# EasyEDA Pro project Camera.eprj

# Schematic Schematic1
Board Name: Board1; Create Date: 2025-09-21; Page Name: P1; Project Name: Camera; Schematic Name: Schematic1; Update Date: 2025-10-05; Company: 嘉立创EDA; Page Size: A4; Version: V1.0
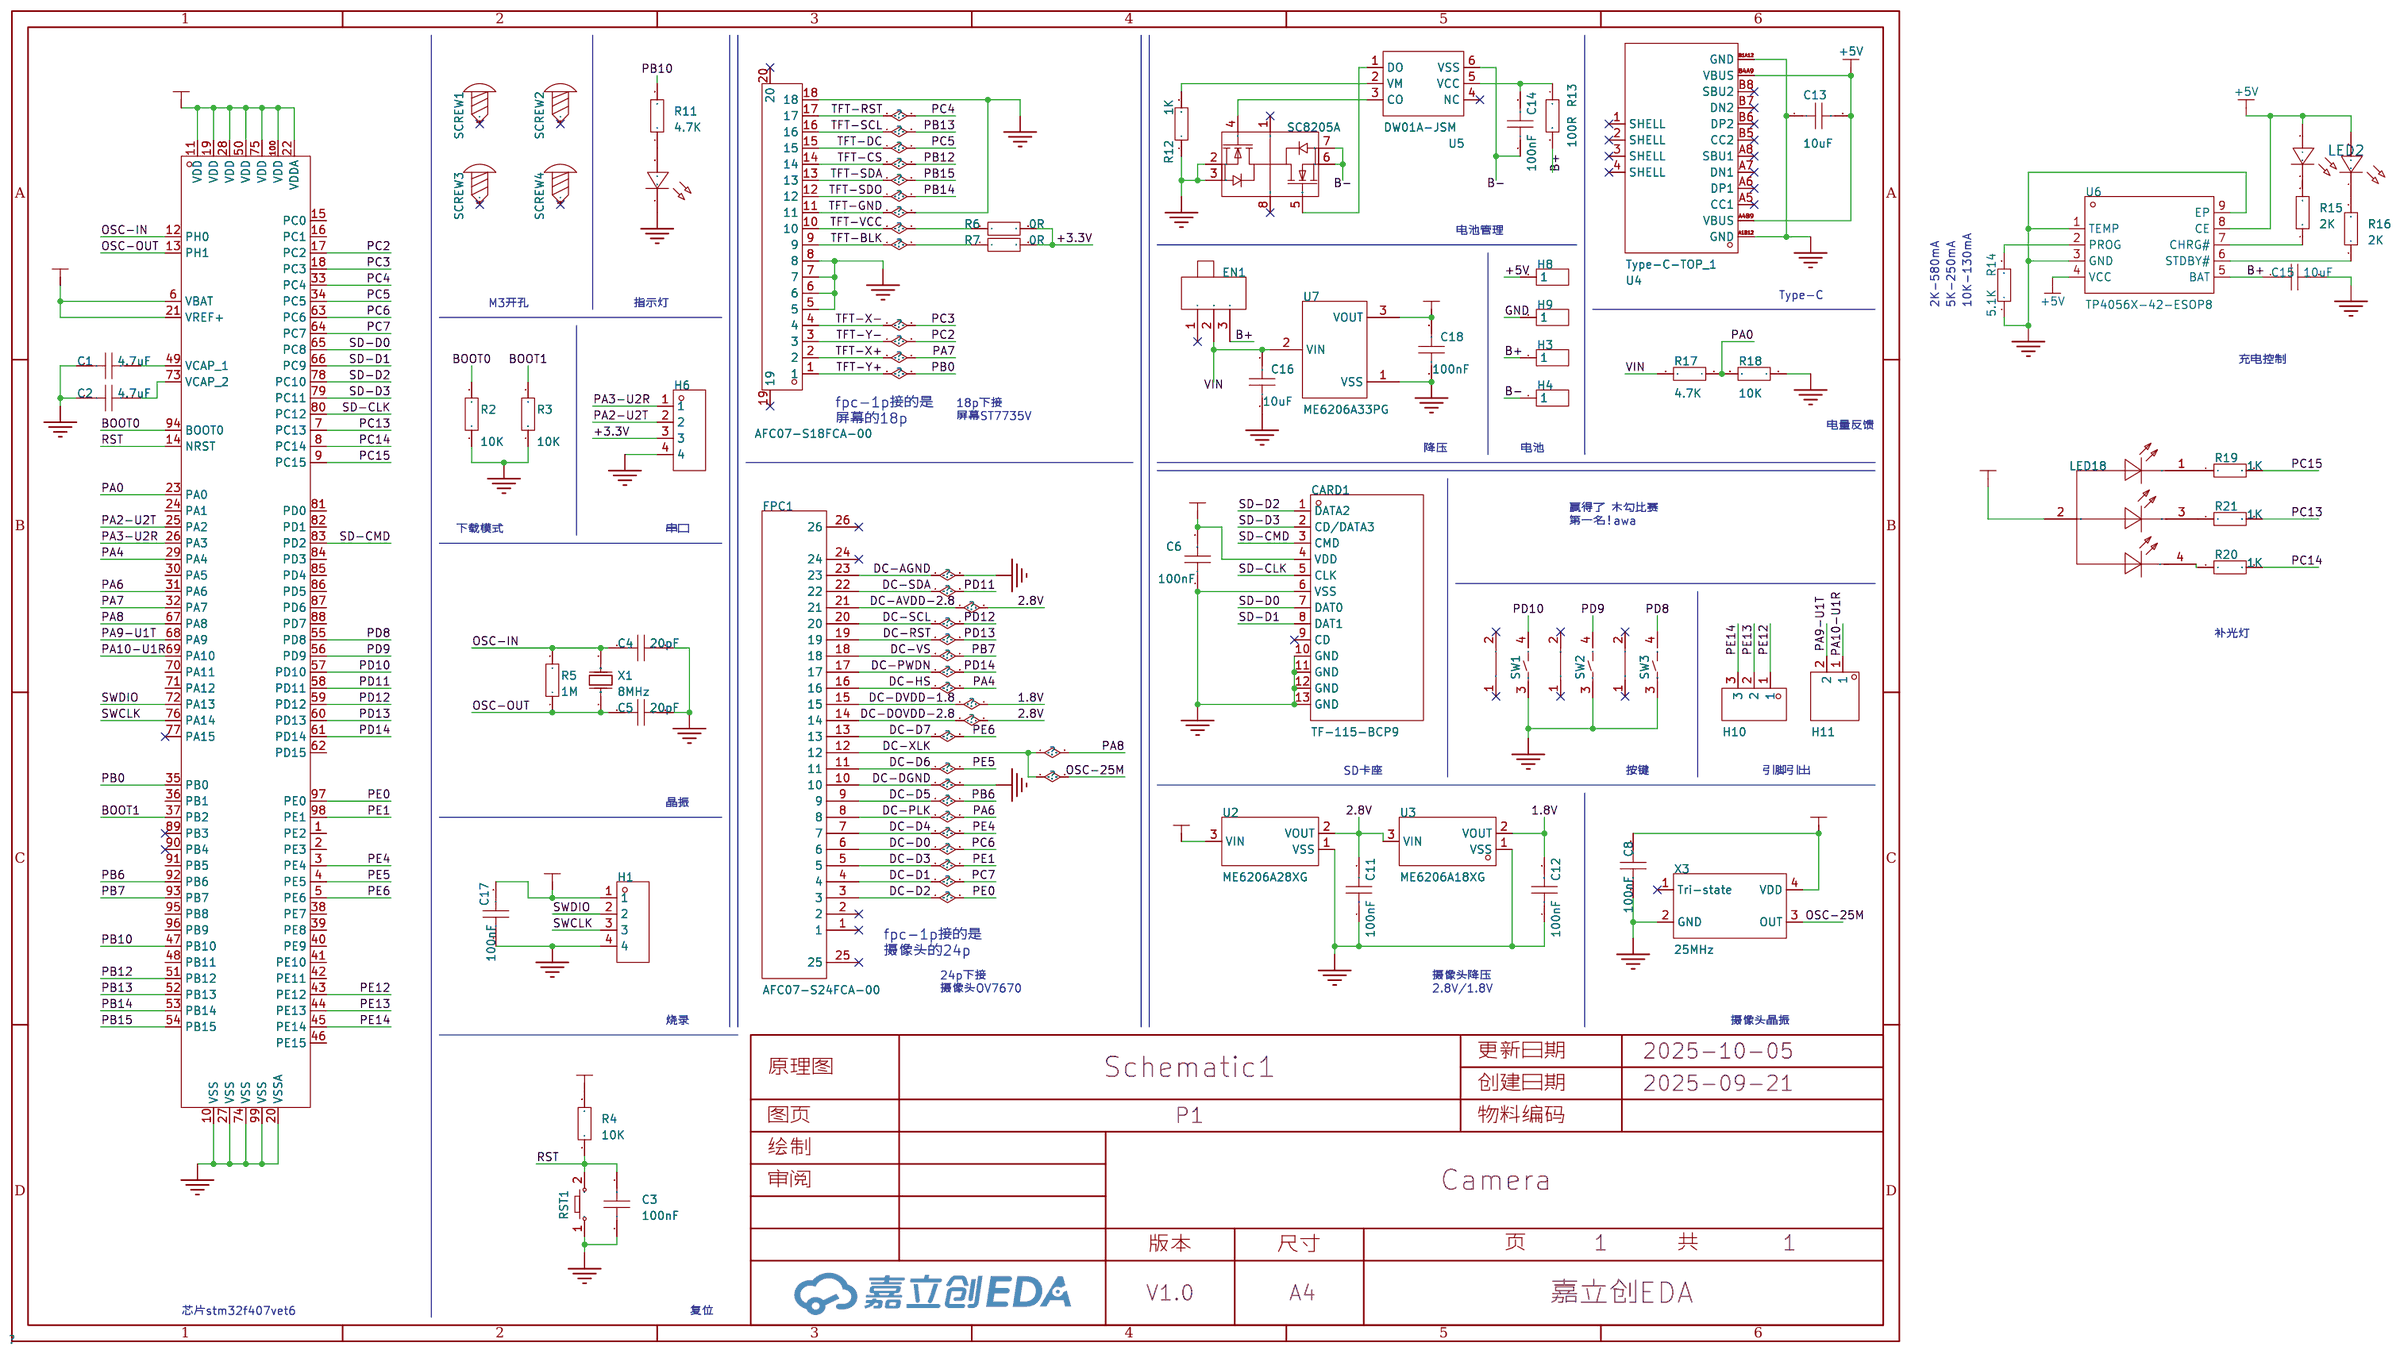
[diagram p0: schematic sheet]

## Parts
C1  4.7uF  [C0805]
C2  4.7uF  [C0805]
C3  100nF  [C0805]
C4  20pF  [C0805]
C5  20pF  [C0805]
C6  100nF  [C0805]
C8  100nF  [C0805]
C11  100nF  [C0805]
C12  100nF  [C0805]
C13  10uF  [C0805]
C14  100nF  [C0805]
C15  10uF  [C0805]
C16  10uF  [C0805]
C17  100nF  [C0805]
C18  100nF  [C0805]
CARD1  TF-115-BCP9  [TF-SMD_TF-115-BCP9]
EN1  MK-12C01N-G1.5  [SW-SMD_DEALON_MK-12C01N-G1.5]
FPC1  AFC07-S24FCA-00  [FPC-SMD_AFC07-S24FCA-00]
H1  -  [HDR-TH_4P-P2.54-V-M]
H3  -  [HDR-TH_1P-V-M_XKB_X4611WV-01I-C28D40]
H4  -  [HDR-TH_1P-V-M_XKB_X4611WV-01I-C28D40]
H6  -  [HDR-TH_4P-P2.54-V-M]
H8  -  [HDR-TH_1P-V-M_XKB_X4611WV-01I-C28D40]
H9  -  [HDR-TH_1P-V-M_XKB_X4611WV-01I-C28D40]
H10  -  [HDR-TH_3P-P2.54-V-M]
H11  -  [HDR-TH_2P-P2.54-V-M-1]
LED1  -  [LED_0805]
LED2  -  [LED_0805]
LED3  -  [LED_0805]
LED18  LED-SMD-全彩四脚RGB黑面雾状-3528  [LED-SMD_FM-3528RGBA-HF]
Q1  SC8205A  [TSSOP-8_L4.4-W3.0-P0.65-LS6.4-BL]
R2  10K  [R0805]
R3  10K  [R0805]
R4  10K  [R0805]
R5  1M  [R0805]
R6  0R  [R0805]
R7  0R  [R0805]
R11  4.7K  [R0805]
R12  1K  [R0805]
R13  100R  [R0805]
R14  5.1K  [R0805]
R15  2K  [R0805]
R16  2K  [R0805]
R17  4.7K  [R0805]
R18  10K  [R0805]
R19  1K  [R0805]
R20  1K  [R0805]
R21  1K  [R0805]
RST1  -  [Key_SMD_3x4x2]
SCREW1  -  [M3螺丝]
SCREW2  -  [M3螺丝]
SCREW3  -  [M3螺丝]
SCREW4  -  [M3螺丝]
SW1  HX-2x4x3.5CA-2.5N  [SW-SMD_HX-2X4X3.5CA-2.5N]
SW2  HX-2x4x3.5CA-2.5N  [SW-SMD_HX-2X4X3.5CA-2.5N]
SW3  HX-2x4x3.5CA-2.5N  [SW-SMD_HX-2X4X3.5CA-2.5N]
U1  STM32F407VET6TR  [LQFP-100_L14.0-W14.0-P0.50-LS16.0-BL]
U2  ME6206A28XG  [SOT-23_L2.9-W1.3-P1.90-LS2.4-BR]
U3  ME6206A18XG  [SOT-23_L2.9-W1.3-P1.90-LS2.4-BR]
U4  Type-C-TOP_1  [USB-C-SMD_TYPE-C16PIN]
U5  DW01A-JSM  [SOT-23-6_L2.9-W1.6-P0.95-LS2.8-BR]
U6  TP4056X-42-ESOP8  [SOP-8_L4.9-W3.9-P1.27-LS6.0-TL-EP]
U7  ME6206A33PG  [SOT-89-3_L4.5-W2.5-P1.50-LS4.2-BR]
X1  8MHz  [HC-49S_L11.5-W4.8]
X2  AFC07-S18FCA-00  [FPC-SMD_AFC07-S18FCA-00]
X3  25MHz  [OSC-SMD_4P-L5.0-W3.2-BL_A]

## Library data of the parts
C1-C6 C8 C11-C18 = CAP_0805: Supplier Footprint: 0805
CARD1 = TF-115-BCP9: 卡连接方式:自弹式;卡类型:MicroSD卡(TF卡);连接器类型:卡座;本体最大高度:1.8mm;工作温度范围:-25℃~+85℃;; LCSC Part Name: 自弹式 MicroSD卡(TF卡) 卡座; Supplier Part: C720505; Manufacturer: XUNPU(讯普); Supplier Footprint: SMD; JLCPCB Part Class: 扩展库; Datasheet: https://atta.szlcsc.com/upload/public/pdf/source/20210906/DBEC8F03AA1503572333C7CF4A76D0AD.pdf; Supplier: LCSC; Card Connection Mode: 自弹式; Card Type: MicroSD卡(TF卡); Connector Type: 卡座; Maximum Body Height: 1.8mm; Operating Temperature Range: -25℃~+85℃
EN1 = MK-12C01N-G1.5: 电路结构:单刀双掷;安装方式:卧贴;开关颜色:黑色;机械寿命:-;; LCSC Part Name: 微型拨动开关; Supplier Part: C2904923; Manufacturer: DEALON(德艺隆); Supplier Footprint: SMD; JLCPCB Part Class: 扩展库; Datasheet: https://atta.szlcsc.com/upload/public/pdf/source/20211116/DB0E76B2A5CCB6919F2C3E33154185CD.pdf; Supplier: LCSC; Circuit: 单刀双掷; Actuator Style: 矩形柱状; Pin Style: 鸥翼型; Switch Length: 7mm; Switch Width: 1.5mm; Switch Height: 4.5mm; Mounting Style: 卧贴; Actuator Color: 黑色
FPC1 = AFC07-S24FCA-00: LCSC Part Name: 间距:0.5mm P数:24P 抽屉式 下接; Supplier Part: C262567; Manufacturer: JS(钜硕电子); Supplier Footprint: SMD,P=0.5mm,卧贴; JLCPCB Part Class: 扩展库; Datasheet: https://item.szlcsc.com/datasheet/AFC07-S24FCA-00/253876.html; Supplier: LCSC; Locking Feature: 抽屉式; Contact Type: 下接; Number of Contacts: 24P; Pitch: 0.5mm; Mounting Type: 卧贴; FFC, FCB Thickness: 0.3mm; Height Above Board: 2mm
H1 H6 = HDR-M_2.54_1x4P: Supplier Part: C492403; Supplier Footprint: 插件
H3 H4 H8 H9 = HDR-M_2.54_1x1P: Supplier Part: C81276; Supplier Footprint: 插件; JLCPCB Part Class: Extended Part
H10 = HDR-M_2.54_1x3P: Supplier Part: C2937625; Supplier Footprint: 插件
H11 = HDR-M_2.54_1x2P: Supplier Part: C124375; Supplier Footprint: 插件
LED1 = LED_0805-B: Supplier Footprint: 0805
LED2 = LED_0805-R: Supplier Footprint: 0805
LED3 = LED_0805-G: Supplier Footprint: 0805
LED18 = LED-SMD-全彩四脚RGB黑面雾状-3528: Supplier Part: C9900014091; JLCPCB Part Class: 扩展库; Supplier: LCSC
Q1 = SC8205A: 数量:2个N沟道;漏源电压(Vdss):20V;连续漏极电流(Id):-;导通电阻(RDS(on)):25mΩ@10V,5A;耗散功率(Pd):2W;阈值电压(Vgs(th)):1.5V;; LCSC Part Name: 2个N沟道 耐压:20V 电流:6A; Supplier Part: C83931; Manufacturer: FM(富满); Supplier Footprint: TSSOP-8; JLCPCB Part Class: 扩展库; Datasheet: https://item.szlcsc.com/datasheet/SC8205A/85099.html; Supplier: LCSC; Number: 2个N沟道; Drain to Source Voltage: 20V; RDS(on): 25mΩ@10V,5A; Pd - Power Dissipation: 2W; Gate Threshold Voltage (Vgs(th)): 1.5V
R2-R7 R11-R21 = Res_0805: Supplier Footprint: 0805
RST1 = Key_SMD_3x4x2: Supplier Footprint: SMD
SCREW1-SCREW4 = M3螺丝: Supplier Footprint: 插件
SW1-SW3 = HX-2x4x3.5CA-2.5N: LCSC Part Name: 4.55*1.8*3.5mm 卧贴 轻触开关; Supplier Part: C49234137; Manufacturer: hanxia(韩下); Supplier Footprint: SMD; JLCPCB Part Class: 扩展库; Datasheet: https://item.szlcsc.com/datasheet/HX-2x4x3.5CA-2.5N/51650198.html; Supplier: LCSC; Circuit: 单刀单掷; Operating Force: 2.5N; Mounting Type: 卧贴; Length: 4.55mm; Width: 1.8mm; Switch Height: 3.5mm; with Bracket: 不带支架; Contact Current: 50mA; Voltage Rating: 12V; Actuator/Cap Color: 黑色; With Lamp: 无; Termination Style: SMD接片; Life: 2万次
U1 = STM32F407VET6TR: CPU内核:ARM-M4;CPU最大主频:168MHz;应用领域:-;; LCSC Part Name: 带DSP和FPU的高性能基础系列ARM Cortex-M4 MCU，具有512 KB Flash、168 MHz CPU、ART加速器、以太网和FSMC; Supplier Part: C5269943; Manufacturer: ST(意法半导体); Supplier Footprint: LQFP-100(14x14); JLCPCB Part Class: 扩展库; Datasheet: https://atta.szlcsc.com/upload/public/pdf/source/20201130/C919362_39400D478C258148B3DF984CE4A4041A.pdf; Supplier: LCSC; CPU Core: ARM-M4; CPU Maximum Speed: 168MHz; Number of I/O: 82; ADC (Bit): 12bit; DAC (Bit): 12bit; Low Voltage Detection Threshold: 1.8V~3.6V
U2 = ME6206A28XG: LCSC Part Name: 输入6V 输出2.8V 300mA; Supplier Part: C236702; Manufacturer: MICRONE(南京微盟); Supplier Footprint: SOT-23; JLCPCB Part Class: 扩展库; Datasheet: https://atta.szlcsc.com/upload/public/pdf/source/20180709/C236710_17D59B8921B23E717C74E2DD8882F2F4.pdf; Supplier: LCSC; Output Type: 固定; Voltage - Supply: 6V; Output Voltage: 2.8V; Output Current: 300mA; Power Supply Rejection Ratio (PSRR): 50dB@(1kHz); Voltage Dropout: 380mV@(200mA); standby current: 8uA; Features: 短路保护；过流保护; Operating Temperature: -25℃~+125℃@(Ta); Output Configuration: 正极; Number of Outputs: 1
U3 = ME6206A18XG: LCSC Part Name: 输入6V 输出1.8V 120mA; Supplier Part: C236707; Manufacturer: MICRONE(南京微盟); Supplier Footprint: SOT-23; JLCPCB Part Class: 扩展库; Datasheet: https://item.szlcsc.com/datasheet/ME6206A18XG/236147.html; Supplier: LCSC; Output Type: 固定; Voltage - Supply: 6V; Output Voltage: 1.8V; Output Current: 120mA; Power Supply Rejection Ratio (PSRR): 45dB@(1kHz); Voltage Dropout: 200mV@(20mA); standby current: 8uA; Features: 短路保护；过流保护; Operating Temperature: -25℃~+125℃@(Ta); Output Configuration: 正极; Number of Outputs: 1
U4 = Type-C-TOP_1: Supplier Part: C9900005857; Supplier Footprint: Type-C16P; JLCPCB Part Class: 扩展库; Supplier: LCSC
U5 = DW01A-JSM: 工作电压:300mV~6V;最大充电电流:-;; LCSC Part Name: 单节锂电池保护IC; Supplier Part: C39846919; Manufacturer: JSMSEMI(杰盛微); Supplier Footprint: SOT-23-6; Datasheet: https://item.szlcsc.com/datasheet/DW01A-JSM/41578852.html; Supplier: LCSC; The Chip Type: 电池保护芯片; Voltage - Supply: 300mV~6V
U6 = TP4056X-42-ESOP8: 工作电压:4V~8V;最大充电电流:1A;电池类型:锂离子/聚合物;电池节数:1;; Supplier Part: C2763448; Manufacturer: TOPPOWER(南京拓微); Supplier Footprint: SOP-8-EP; JLCPCB Part Class: 扩展库; Datasheet: https://item.szlcsc.com/datasheet/TP4056X-42-ESOP8/2893069.html; Supplier: LCSC; The Chip Type: 线性充电芯片; Voltage - Supply: 4V~8V; Charge Current - Max: 1A; Charging Saturation Voltage: 4.2V; Type of Battery: 锂离子/聚合物; Number of Cells: 1; Operating Temperature: -40℃~+85℃; Battery Temperature Detection: 支持; Supply Current (Iq): 70uA
U7 = ME6206A33PG: 输出类型:固定;工作电压:6V;输出电压:3.3V;输出电流:300mA;电源纹波抑制比(PSRR):50dB@(1kHz);输出极性:正极;; LCSC Part Name: 输入6V 输出3.3V 300mA; Supplier Part: C79022; Manufacturer: MICRONE(南京微盟); Supplier Footprint: SOT-89-3; JLCPCB Part Class: 扩展库; Datasheet: https://item.szlcsc.com/datasheet/ME6206A33PG/80159.html; Supplier: LCSC; Output Type: 固定; Voltage - Supply: 6V; Output Voltage: 3.3V; Output Current: 300mA; Power Supply Rejection Ratio (PSRR): 50dB@(1kHz); Voltage Dropout: 180mV@(80mA)；380mV@(200mA); standby current: 9uA; Features: 过流保护; Operating Temperature: -25℃~+85℃; Output Configuration: 正极; Number of Outputs: 1
X1 = 49SAT080000201060: 晶振类型:贴片晶振;频率:8MHz;常温频差:±10ppm;外接负载电容:20pF;; LCSC Part Name: 8MHz ±10ppm 20pF; Supplier Part: C390758; Manufacturer: JGHC(晶光华); Supplier Footprint: HC-49S-SMD; JLCPCB Part Class: 扩展库; Datasheet: https://atta.szlcsc.com/upload/public/pdf/source/20200102/C479159_77354EAC8C21D1127CB2E163DDA33705.pdf; Supplier: LCSC; Crystal Type: 贴片晶振; Normal temperature Frequency Tolerance: ±10ppm; External load capacitor: 20pF; Operating Temperature: -20℃~+70℃
X2 = AFC07-S18FCA-00: LCSC Part Name: 间距:0.5mm P数:18P 抽屉式 下接; Supplier Part: C262564; Manufacturer: JS(钜硕电子); Supplier Footprint: SMD,P=0.5mm,卧贴; JLCPCB Part Class: 扩展库; Datasheet: https://atta.szlcsc.com/upload/public/pdf/source/20190726/C11047_78689421E6D6672DE8D11ECCF89B3729.pdf; Supplier: LCSC; Locking Feature: 抽屉式; Contact Type: 下接; Number of Contacts: 18P; Pitch: 0.5mm; Mounting Type: 卧贴; FFC, FCB Thickness: 0.3mm; Height Above Board: 2mm
X3 = OT503225MJBA4SL: LCSC Part Name: YSO110TR 25MHZ 4P 5032 1.8V-3.3V ±10PPM -40~85℃（±20PPM) CMOS; Supplier Part: C717795; Manufacturer: YXC(扬兴晶振); Supplier Footprint: SMD5032-4P; JLCPCB Part Class: 扩展库; Datasheet: https://item.szlcsc.com/datasheet/OT503225MJBA4SL/758655.html; Supplier: LCSC; Normal temperature Frequency Tolerance: ±10ppm; Output Type: CMOS; Voltage - Supply: 1.8V~3.3V; Frequency Stability: ±20ppm; Operating Temperature: -40℃~+85℃

## Nets
1.8V: C12.2 FPC1.15 U3.2(VOUT)
2.8V: C11.2 FPC1.14 FPC1.21 U2.2(VOUT) U3.3(VIN)
+3.3V: C6.2 C8.2 C17.2 C18.2 CARD1.4(VDD) H1.1 H6.3 LED18.2 R4.2 R6.2 R7.2 U1.6(VBAT) U1.11(VDD) U1.19(VDD) U1.21(VREF+) U1.22(VDDA) U1.28(VDD) U1.50(VDD) U1.75(VDD) U1.100(VDD) U2.3(VIN) U7.3(VOUT) X3.4(VDD)
+5V: C13.2 H8.1 LED2.2(A) LED3.2(A) U4.A4B9(VBUS) U4.B4A9(VBUS) U6.4(VCC) U6.8(CE)
GND: C1.1 C2.1 C3.1 C4.2 C5.2 C6.1 C8.1 C11.1 C12.1 C13.1 C15.2 C16.1 C17.1 C18.1 CARD1.6(VSS) CARD1.10(GND) CARD1.11(GND) CARD1.12(GND) CARD1.13(GND) FPC1.10 FPC1.23 H1.4 H6.4 H9.1 LED1.1(C) Q1.2(S1) Q1.3(S1) R2.1 R3.1 R12.1 R14.1 R18.1 RST1.1 SW1.3 SW2.3 SW3.3 U1.10(VSS) U1.20(VSSA) U1.27(VSS) U1.74(VSS) U1.99(VSS) U2.1(VSS) U3.1(VSS) U4.A1B12(GND) U4.B1A12(GND) U6.1(TEMP) U6.3(GND) U6.9(EP) U7.1(VSS) X2.5 X2.6 X2.7 X2.8 X2.11 X2.18 X3.2(GND)
VIN: C16.2 EN1.2 R17.2 U7.2(VIN)
B+: C15.1 EN1.3 H3.1 R13.2 U6.5(BAT)
B-: C14.1 H4.1 Q1.6(S2) Q1.7(S2) U5.6(VSS)
BOOT0: R2.2 U1.94(BOOT0)
BOOT1: R3.2 U1.37(PB2)
DC-D0: FPC1.6 U1.63(PC6)
DC-D1: FPC1.4 U1.64(PC7)
DC-D2: FPC1.3 U1.97(PE0)
DC-D3: FPC1.5 U1.98(PE1)
DC-D4: FPC1.7 U1.3(PE4)
DC-D5: FPC1.9 U1.92(PB6)
DC-D6: FPC1.11 U1.4(PE5)
DC-D7: FPC1.13 U1.5(PE6)
DC-HS: FPC1.16 U1.29(PA4)
DC-PLK: FPC1.8 U1.31(PA6)
DC-PWDN: FPC1.17 U1.61(PD14)
DC-RST: FPC1.19 U1.60(PD13)
DC-SCL: FPC1.20 U1.59(PD12)
DC-SDA: FPC1.22 U1.58(PD11)
DC-VS: FPC1.18 U1.93(PB7)
DC-XLK: FPC1.12 U1.67(PA8) X3.3(OUT)
OSC-IN: C4.1 R5.2 U1.12(PH0) X1.2(OSC2)
OSC-OUT: C5.1 R5.1 U1.13(PH1) X1.1(OSC1)
PA0: R17.1 R18.2 U1.23(PA0)
PA2-U2T: H6.2 U1.25(PA2)
PA3-U2R: H6.1 U1.26(PA3)
PA7: U1.32(PA7) X2.2
PA9-U1T: H11.2 U1.68(PA9)
PA10-U1R: H11.1 U1.69(PA10)
PB0: U1.35(PB0) X2.1
PB10: R11.2 U1.47(PB10)
PB12: U1.51(PB12) X2.14
PB13: U1.52(PB13) X2.16
PB14: U1.53(PB14) X2.12
PB15: U1.54(PB15) X2.13
PC2: U1.17(PC2) X2.3
PC3: U1.18(PC3) X2.4
PC4: U1.33(PC4) X2.17
PC5: U1.34(PC5) X2.15
PC13: R21.2 U1.7(PC13)
PC14: R20.2 U1.8(PC14)
PC15: R19.2 U1.9(PC15)
PD8: SW3.4 U1.55(PD8)
PD9: SW2.4 U1.56(PD9)
PD10: SW1.4 U1.57(PD10)
PE12: H10.1 U1.43(PE12)
PE13: H10.2 U1.44(PE13)
PE14: H10.3 U1.45(PE14)
RST: C3.2 R4.1 RST1.2 U1.14(NRST)
SD-CLK: CARD1.5(CLK) U1.80(PC12)
SD-CMD: CARD1.3(CMD) U1.83(PD2)
SD-D0: CARD1.7(DAT0) U1.65(PC8)
SD-D1: CARD1.8(DAT1) U1.66(PC9)
SD-D2: CARD1.1(DATA2) U1.78(PC10)
SD-D3: CARD1.2(CD/DATA3) U1.79(PC11)
SWCLK: H1.3 U1.76(PA14)
SWDIO: H1.2 U1.72(PA13)
TFT-BLK: R7.1 X2.9
TFT-VCC: R6.1 X2.10
$1N1237: C1.2 U1.49(VCAP_1)
$1N1238: C2.2 U1.73(VCAP_2)
$1N6160: R15.1 U6.7(CHRG#)
$1N6161: R16.1 U6.6(STDBY#)
$1N6166: R14.2 U6.2(PROG)
$1N6175: C14.2 R13.1 U5.5(VCC)
$1N6180: R12.2 U5.2(VM)
$1N6185: Q1.4(G1) U5.3(CO)
$1N6186: Q1.5(G2) U5.1(DO)
$1N8698: LED2.1(C) R15.2
$1N13231: LED18.1(R) R19.1
$1N13309: LED18.4(G) R20.1
$1N14969: LED18.3(B) R21.1
Net-(LED1-2): LED1.2(A) R11.1
Net-(LED3-1): LED3.1(C) R16.2

Not connected (* = marked no-connect by the designer): CARD1 9(CD)*; EN1 1*; FPC1 1* 2* 24* 25* 26*; Q1 1(D12)* 8(D12)*; SCREW1 1*; SCREW2 1*; SCREW3 1*; SCREW4 1*; SW1 1* 2*; SW2 1* 2*; SW3 1* 2*; U1 1(PE2) 2(PE3) 15(PC0) 16(PC1) 24(PA1) 30(PA5) 36(PB1) 38(PE7) 39(PE8) 40(PE9) 41(PE10) 42(PE11) 46(PE15) 48(PB11) 62(PD15) 70(PA11) 71(PA12) 77(PA15)* 81(PD0) 82(PD1) 84(PD3) 85(PD4) 86(PD5) 87(PD6) 88(PD7) 89(PB3)* 90(PB4)* 91(PB5) 95(PB8) 96(PB9); U4 1(SHELL)* 2(SHELL)* 3(SHELL)* 4(SHELL)* A5(CC1)* A6(DP1)* A7(DN1)* A8(SBU1)* B5(CC2)* B6(DP2)* B7(DN2)* B8(SBU2)*; U5 4(NC)*; X2 19* 20*; X3 1(Tri-state)*

## Notes on the sheet
- 电池管理
- Type-C
- M3开孔
- 指示灯
- 2K-580mA
- 5K-250mA
- 10K-130mA
- 充电控制
- fpc-1p接的是
  屏幕的18p
- 18p下接
  屏幕ST7735V
- 电量反馈
- 降压
- 电池
- 赢得了 木勾比赛
  第一名！awa
- 下载模式
- 串口
- 补光灯
- SD卡座
- 按键
- 引脚引出
- 晶振
- fpc-1p接的是
  摄像头的24p
- 24p下接
  摄像头OV7670
- 摄像头降压
  2.8V/1.8V
- 烧录
- 摄像头晶振
- 芯片stm32f407vet6
- 复位

# Board PCB1
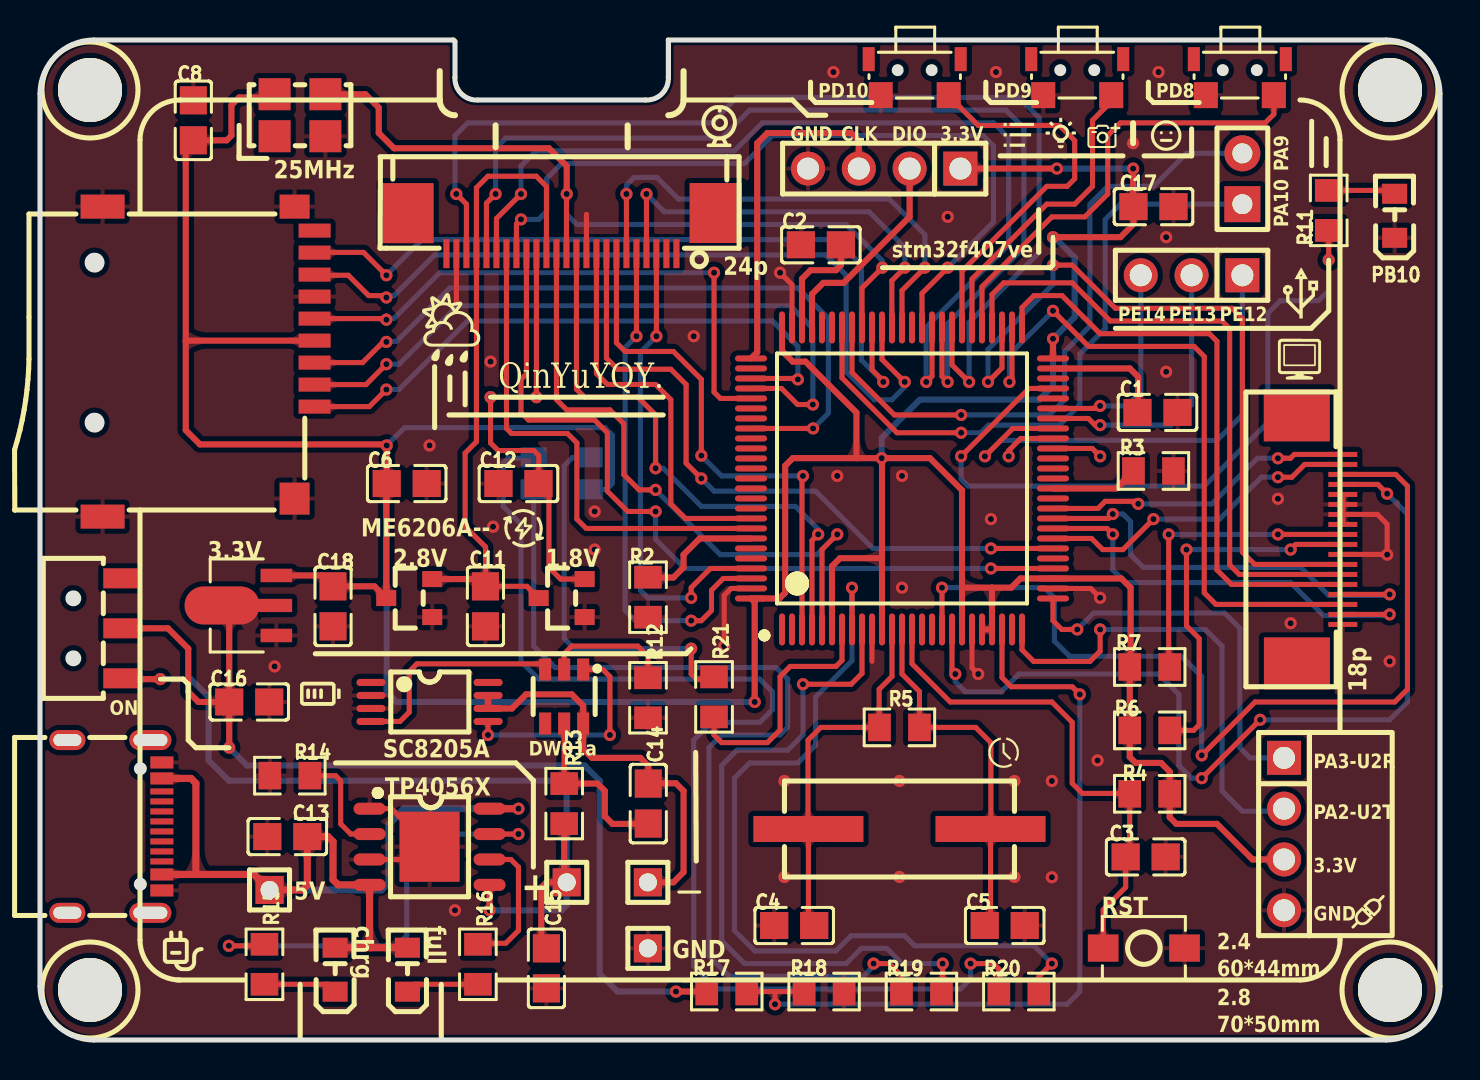
[diagram p1: board, top side]
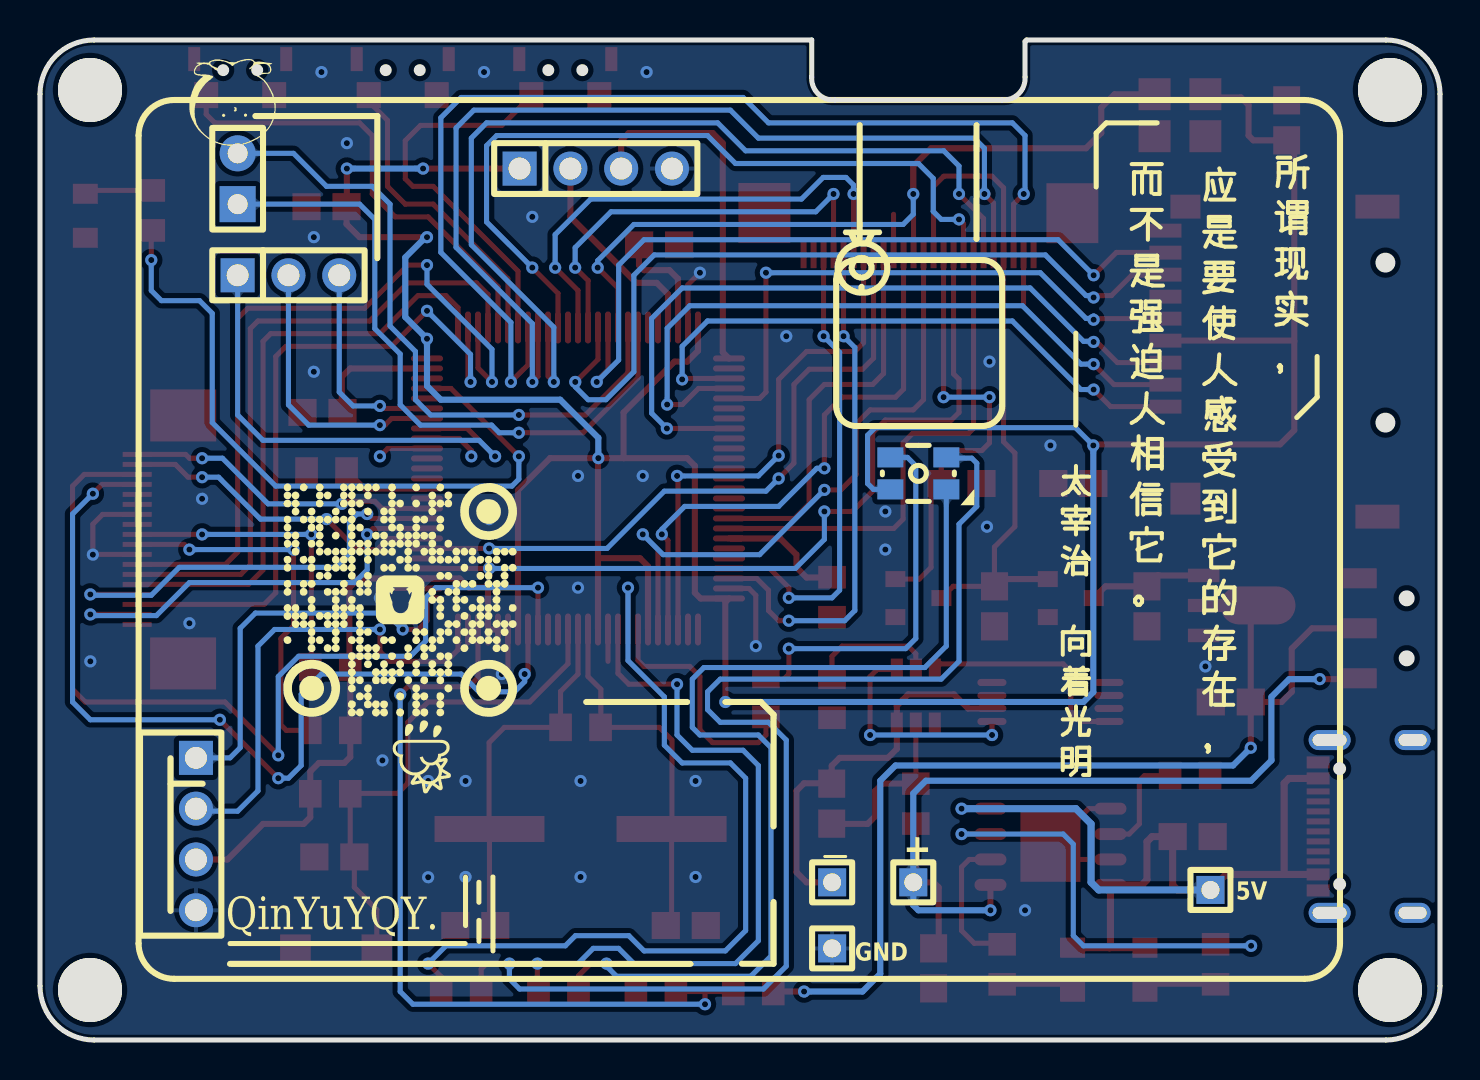
[diagram p2: board, bottom side, seen from below]

Outline 70 x 50 mm; copper layers: Top Layer, Bottom Layer. Coordinates in mm from the lower left corner of the outline.
Outline path: 0,47.3 arc(0.79,49.21) 2.7,50 20.67,50 20.75,49.92 20.75,48.14 arc(21.06,47.31) 21.89,47 30.27,47 arc(31.1,47.31) 31.42,48.14 31.42,50 67.3,50 arc(69.21,49.21) 70,47.3 70,2.7 arc(69.21,0.79) 67.3,0 2.7,0 arc(0.79,0.79) 0,2.7 0,47.3
Stack: Top Layer 0.035mm / Dielectric1 1.51mm FR4 er 4.5 / Bottom Layer 0.035mm

## Design rules (mm)
net OSC-OUT: DP1
net OSC-IN: DP1
template: 自定义配置
spacing copperThickness1oz (default): track to track 0.102, other pairs 0.152 to 0.3
spacing copperThickness2oz: track to track 0.203, other pairs 0.152 to 0.3
track width copperThickness1oz (default): min 0.127, default 0.254, max 2.54
track width copperThickness2oz: min 0.203, default 0.254, max 2.54
differential pair differentialPair (default): width min 0.127, default 0.254, max 2.54; gap min 0.152, default 0.152
via viaSize (default): diameter min 0.5, default 0.61, max 10; hole min 0.3, default 0.305, max 6.299

## Placement (name value [footprint] x y rotation side)
C1  4.7uF  [C0805]  55.88 31.38 180 top
C2  4.7uF  [C0805]  39.04 39.76 0 top
C3  100nF  [C0805]  55.28 9.15 180 top
C4  20pF  [C0805]  37.71 5.72 180 top
C5  20pF  [C0805]  48.24 5.72 0 top
C6  100nF  [C0805]  18.34 27.82 180 top
C8  100nF  [C0805]  7.67 45.98 270 top
C11  100nF  [C0805]  22.27 21.68 90 top
C12  100nF  [C0805]  23.92 27.82 0 top
C13  10uF  [C0805]  12.37 10.17 0 top
C14  100nF  [C0805]  30.41 11.82 270 top
C15  10uF  [C0805]  25.32 3.58 270 top
C16  10uF  [C0805]  10.46 16.9 180 top
C17  100nF  [C0805]  55.67 41.67 180 top
C18  100nF  [C0805]  14.65 21.68 90 top
CARD1  TF-115-BCP9  [TF-SMD_TF-115-BCP9]  8.43 33.92 270 top
EN1  MK-12C01N-G1.5  [SW-SMD_DEALON_MK-12C01N-G1.5]  4.02 20.58 270 top
FPC1  AFC07-S24FCA-00  [FPC-SMD_AFC07-S24FCA-00]  26.08 40.4 180 top
FULL  -  [LED_0805]  18.38 3.57 90 top
H1  -  [HDR-TH_4P-P2.54-V-M]  42.21 43.57 180 top
H3  -  [HDR-TH_1P-V-M_XKB_X4611WV-01I-C28D40]  26.34 7.88 0 top
H4  -  [HDR-TH_1P-V-M_XKB_X4611WV-01I-C28D40]  30.39 7.88 0 top
H6  -  [HDR-TH_4P-P2.54-V-M]  62.2 10.3 270 top
H8  -  [HDR-TH_1P-V-M_XKB_X4611WV-01I-C28D40]  11.48 7.5 0 top
H9  -  [HDR-TH_1P-V-M_XKB_X4611WV-01I-C28D40]  30.39 4.58 0 top
H10  -  [HDR-TH_3P-P2.54-V-M]  57.58 38.24 180 top
H11  -  [HDR-TH_2P-P2.54-V-M-1]  60.12 43.06 90 top
LED2  -  [LED_0805]  14.76 3.57 90 top
LED18  LED-SMD-全彩四脚RGB黑面雾状-3528  [LED-SMD_FM-3528RGBA-HF]  26.08 28.33 180 bottom
PB10  -  [LED_0805]  67.74 41.26 90 top
Q1  SC8205A  [TSSOP-8_L4.4-W3.0-P0.65-LS6.4-BL]  19.48 16.9 270 top
R2  10K  [R0805]  30.4 22.14 90 top
R3  10K  [R0805]  55.67 28.45 180 top
R4  10K  [R0805]  55.49 12.31 0 top
R5  1M  [R0805]  42.97 15.63 180 top
R6  0R  [R0805]  55.49 15.48 180 top
R7  0R  [R0805]  55.49 18.65 180 top
R11  4.7K  [R0805]  64.44 41.48 270 top
R12  1K  [R0805]  30.4 17.11 90 top
R13  100R  [R0805]  26.21 11.82 270 top
R14  5.1K  [R0805]  12.49 13.22 0 top
R15  2K  [R0805]  11.22 3.79 270 top
R16  2K  [R0805]  21.89 3.79 270 top
R17  4.7K  [R0805]  34.34 2.42 180 top
R18  10K  [R0805]  39.21 2.42 180 top
R19  1K  [R0805]  44.07 2.42 0 top
R20  1K  [R0805]  48.94 2.42 0 top
R21  1K  [R0805]  33.7 17.16 270 top
RST1  -  [Key_SMD_3x4x2]  55.19 4.6 180 top
SCREW1  -  [M3螺丝]  2.5 47.5 0 top
SCREW2  -  [M3螺丝]  67.5 2.5 0 top
SCREW3  -  [M3螺丝]  2.5 2.5 0 top
SCREW4  -  [M3螺丝]  67.5 47.5 0 top
SW1  HX-2x4x3.5CA-2.5N  [SW-SMD_HX-2X4X3.5CA-2.5N]  43.74 48.14 0 top
SW2  HX-2x4x3.5CA-2.5N  [SW-SMD_HX-2X4X3.5CA-2.5N]  51.86 48.14 0 top
SW3  HX-2x4x3.5CA-2.5N  [SW-SMD_HX-2X4X3.5CA-2.5N]  59.99 48.14 0 top
U1  STM32F407VET6TR  [LQFP-100_L14.0-W14.0-P0.50-LS16.0-BL]  43.1 28.08 0 top
U2  ME6206A28XG  [SOT-23_L2.9-W1.3-P1.90-LS2.4-BR]  18.46 22.1 0 top
U3  ME6206A18XG  [SOT-23_L2.9-W1.3-P1.90-LS2.4-BR]  26.08 22.1 0 top
U4  Type-C-TOP_1  [USB-C-SMD_TYPE-C16PIN]  3.73 10.68 270 top
U5  DW01A-JSM  [SOT-23-6_L2.9-W1.6-P0.95-LS2.8-BR]  26.21 17.17 90 top
U6  TP4056X-42-ESOP8  [SOP-8_L4.9-W3.9-P1.27-LS6.0-TL-EP]  19.48 9.66 0 top
U7  ME6206A33PG  [SOT-89-3_L4.5-W2.5-P1.50-LS4.2-BR]  10.46 21.73 0 top
X1  8MHz  [HC-49S_L11.5-W4.8]  42.97 10.55 0 top
X2  AFC07-S18FCA-00  [FPC-SMD_AFC07-S18FCA-00]  63.93 25.03 270 top
X3  25MHz  [OSC-SMD_4P-L5.0-W3.2-BL_A]  13 46.24 0 top

## Footprints (pads in the part's own frame, mm; a bottom-side part is the same pattern mirrored in y, then rotated)
C0805
  rect 1.41x1.35 smd: 1(-1,0) 2(1,0)
FPC-SMD_AFC07-S18FCA-00
  rect 0.25x1.45 smd: 1(-4.25,1.214) 2(-3.75,1.214) 3(-3.25,1.214) 4(-2.75,1.214) 5(-2.25,1.214) 6(-1.75,1.214) 7(-1.25,1.214) 8(-0.75,1.214) 9(-0.25,1.214) 10(0.25,1.214) 11(0.75,1.214) 12(1.25,1.214) 13(1.75,1.214) 14(2.25,1.214) 15(2.75,1.214) 16(3.25,1.214) 17(3.75,1.214) 18(4.25,1.214)
  rect 2.6x3.3 smd: 19(6.201,-1.082) 20(-6.201,-1.088)
FPC-SMD_AFC07-S24FCA-00
  rect 0.3x1.45 smd: 1(-5.74,1.078) 2(-5.239,1.078) 3(-4.739,1.078) 4(-4.242,1.078) 5(-3.741,1.078) 6(-3.24,1.078) 7(-2.74,1.078) 8(-2.24,1.078) 9(-1.74,1.078) 10(-1.24,1.078) 11(-0.74,1.078) 12(-0.241,1.078) 13(0.26,1.078) 14(0.76,1.078) 15(1.26,1.078) 16(1.76,1.078) 17(2.26,1.078) 18(2.759,1.078) 19(3.26,1.078) 20(3.76,1.078) 21(4.26,1.078) 22(4.761,1.078) 23(5.261,1.078) 24(5.76,1.078)
  rect 2.6x3 smd: 25(-7.701,-0.952) 26(7.701,-0.946)
HC-49S_L11.5-W4.8
  rect 5.5x1.3 smd: 1(4.553,0) 2(-4.553,0)
HDR-TH_1P-V-M_XKB_X4611WV-01I-C28D40
  rect 1.4x1.4 hole 0.9: 1(0,0)
HDR-TH_2P-P2.54-V-M-1
  rect 1.8x1.8 hole 1: 1(-1.27,0)
  round 1.8 hole 1: 2(1.27,0)
HDR-TH_3P-P2.54-V-M
  rect 1.7x1.7 hole 1.1: 1(-2.54,0)
  round 1.7 hole 1.1: 2(0,0) 3(2.54,0)
HDR-TH_4P-P2.54-V-M
  rect 1.7x1.7 hole 1.1: 1(-3.81,0)
  round 1.7 hole 1.1: 2(-1.27,0) 3(1.27,0) 4(3.81,0)
Key_SMD_3x4x2
  rect 1.53x1.36 smd: 1(-2.035,0) 2(2.035,0)
LED-SMD_FM-3528RGBA-HF
  rect 1.3x1 smd: 1(1.4,-0.8) 2(-1.4,-0.8) 3(-1.4,0.8) 4(1.4,0.8)
LED_0805
  rect 1x1.25 smd: 1(-1.15,0.005) 2(1.05,0.005)
LQFP-100_L14.0-W14.0-P0.50-LS16.0-BL
  oval 0.3x1.6 smd: 1(-6,-7.55) 2(-5.5,-7.55) 3(-5,-7.55) 4(-4.5,-7.55) 5(-4,-7.55) 6(-3.5,-7.55) 7(-3,-7.55) 8(-2.5,-7.55) 9(-2,-7.55) 10(-1.5,-7.55) 11(-1,-7.55) 12(-0.5,-7.55) 13(0,-7.55) 14(0.5,-7.55) 15(1,-7.55) 16(1.5,-7.55) 17(2,-7.55) 18(2.5,-7.55) 19(3,-7.55) 20(3.5,-7.55) 21(4,-7.55) 22(4.5,-7.55) 23(5,-7.55) 24(5.5,-7.55) 25(6,-7.55) 51(6,7.55) 52(5.5,7.55) 53(5,7.55) 54(4.5,7.55) 55(4,7.55) 56(3.5,7.55) 57(3,7.55) 58(2.5,7.55) 59(2,7.55) 60(1.5,7.55) 61(1,7.55) 62(0.5,7.55) 63(0,7.55) 64(-0.5,7.55) 65(-1,7.55) 66(-1.5,7.55) 67(-2,7.55) 68(-2.5,7.55) 69(-3,7.55) 70(-3.5,7.55) 71(-4,7.55) 72(-4.5,7.55) 73(-5,7.55) 74(-5.5,7.55) 75(-6,7.55)
  oval 1.6x0.3 smd: 26(7.55,-6) 27(7.55,-5.5) 28(7.55,-5) 29(7.55,-4.5) 30(7.55,-4) 31(7.55,-3.5) 32(7.55,-3) 33(7.55,-2.5) 34(7.55,-2) 35(7.55,-1.5) 36(7.55,-1) 37(7.55,-0.5) 38(7.55,0) 39(7.55,0.5) 40(7.55,1) 41(7.55,1.5) 42(7.55,2) 43(7.55,2.5) 44(7.55,3) 45(7.55,3.5) 46(7.55,4) 47(7.55,4.5) 48(7.55,5) 49(7.55,5.5) 50(7.55,6) 76(-7.55,6) 77(-7.55,5.5) 78(-7.55,5) 79(-7.55,4.5) 80(-7.55,4) 81(-7.55,3.5) 82(-7.55,3) 83(-7.55,2.5) 84(-7.55,2) 85(-7.55,1.5) 86(-7.55,1) 87(-7.55,0.5) 88(-7.55,0) 89(-7.55,-0.5) 90(-7.55,-1) 91(-7.55,-1.5) 92(-7.55,-2) 93(-7.55,-2.5) 94(-7.55,-3) 95(-7.55,-3.5) 96(-7.55,-4) 97(-7.55,-4.5) 98(-7.55,-5) 99(-7.55,-5.5) 100(-7.55,-6)
M3螺丝
  round 3.2 hole 3.2: 1(0,0)
OSC-SMD_4P-L5.0-W3.2-BL_A
  rect 1.6x1.6 smd: 1(-1.27,-1.05) 2(1.27,-1.05) 3(1.27,1.05) 4(-1.27,1.05)
R0805
  rect 1.133x1.377 smd: 1(-1,0) 2(1,0)
SOP-8_L4.9-W3.9-P1.27-LS6.0-TL-EP
  oval 1.6x0.6 smd: 1(-3,1.905) 2(-3,0.635) 3(-3,-0.635) 4(-3,-1.905) 5(3,-1.905) 6(3,-0.635) 7(3,0.635) 8(3,1.905)
  rect 3x3.5 smd: 9(0,0)
SOT-23-6_L2.9-W1.6-P0.95-LS2.8-BR
  rect 1.1x0.6 smd: 1(1.35,-0.95) 2(1.35,0) 3(1.35,0.95) 4(-1.35,0.95) 5(-1.35,0) 6(-1.35,-0.95)
SOT-23_L2.9-W1.3-P1.90-LS2.4-BR
  rect 1x0.8 smd: 1(1.15,-0.95) 2(1.15,0.95) 3(-1.15,0)
SOT-89-3_L4.5-W2.5-P1.50-LS4.2-BR
  rect 1.575x0.672 smd: 1(1.356,-1.5) 3(1.356,1.5)
  custom 5.377x1.9 smd: 2(-1.356,0)
SW-SMD_DEALON_MK-12C01N-G1.5
  rect 1x1.7 smd: 1(-2.5,0) 2(0,0) 3(2.5,0)
SW-SMD_HX-2X4X3.5CA-2.5N
  rect 0.6x1.2 smd: 1(-2.3,0.9) 2(2.3,0.9)
  rect 1.2x1.3 smd: 3(-1.7,-0.9) 4(1.7,-0.9)
TF-SMD_TF-115-BCP9
  rect 0.7x1.6 smd: 1(2.25,5.3) 2(1.15,5.3) 3(0.05,5.3) 4(-1.05,5.3) 5(-2.15,5.3) 6(-3.25,5.3) 7(-4.35,5.3) 8(-5.45,5.3) 9(-6.55,5.3)
  rect 1.2x1.5 smd: 10(-7.75,4.3)
  rect 1.2x2.2 smd: 11(-7.75,-5.3) 13(7.75,-5.3)
  rect 1.6x1.5 smd: 12(6.85,4.3)
TSSOP-8_L4.4-W3.0-P0.65-LS6.4-BL
  oval 0.353x1.454 smd: 1(-0.975,-2.927) 2(-0.325,-2.927) 3(0.325,-2.927) 4(0.975,-2.927) 5(0.975,2.927) 6(0.325,2.927) 7(-0.325,2.927) 8(-0.975,2.927)
USB-C-SMD_TYPE-C16PIN
  oval 1x2.1 hole 0.6x1.7: 1(-4.32,1.788) 2(4.32,1.788)
  oval 1x1.8 hole 0.6x1.4: 3(-4.32,-2.362) 4(4.32,-2.362)
  rect 0.6x1.15 smd: A1B12(-3.2,2.362) A4B9(-2.4,2.362) B1A12(3.2,2.362) B4A9(2.4,2.362)
  rect 0.3x1.15 smd: A5(-1.25,2.362) A6(-0.25,2.362) A7(0.25,2.362) A8(1.25,2.362) B5(1.75,2.362) B6(0.75,2.362) B7(-0.75,2.362) B8(-1.75,2.362)

## Nets
As in the schematic, except:
+5V: C13.2 FULL.2 H8.1 LED2.2 U4.A4B9 U4.B4A9 U6.4 U6.8
GND: C1.1 C2.1 C3.1 C4.2 C5.2 C6.1 C8.1 C11.1 C12.1 C13.1 C15.2 C16.1 C17.1 C18.1 CARD1.6 CARD1.10 CARD1.11 CARD1.12 CARD1.13 FPC1.10 FPC1.23 H1.4 H6.4 H9.1 PB10.1 Q1.2 Q1.3 R2.1 R3.1 R12.1 R14.1 R18.1 RST1.1 SW1.3 SW2.3 SW3.3 U1.10 U1.20 U1.27 U1.74 U1.99 U2.1 U3.1 U4.A1B12 U4.B1A12 U6.1 U6.3 U6.9 U7.1 X2.5 X2.6 X2.7 X2.8 X2.11 X2.18 X3.2
$1N6188: FULL.1 R16.2
$1N7981: PB10.2 R11.1

Pads without a net: CARD1 9; EN1 1; FPC1 1 2 24 25 26; Q1 1 8; SCREW1 1; SCREW2 1; SCREW3 1; SCREW4 1; SW1 1 2; SW2 1 2; SW3 1 2; U1 1 2 15 16 24 30 36 38 39 40 41 42 46 48 62 70 71 77 81 82 84 85 86 87 88 89 90 91 95 96; U4 1 2 3 4 A5 A6 A7 A8 B5 B6 B7 B8; U5 4; X2 19 20; X3 1

## Via types
v1: diameter 0.61, hole 0.305, Top Layer to Bottom Layer, 136 vias

## Routing (per net, layer and track width the routed paths; a pad name or vN(x,y) marks a point on that pad's centre or on a via; arc(x,y) is an arc through that point)
1.8V: length 22.3
  Top Layer w0.254: U3.2 26.03,23.05 25.45,23.63 25.45,27.3 C12.2 24.94,27.84 24.94,29.22 24.69,29.47 22.91,29.47 22.53,29.86 v1(22.53,32.14) ; FPC1.15 v1(24.82,32.14)
  Bottom Layer w0.254: v1(24.82,32.14) v1(22.53,32.14)
2.8V: length 33.6
  Top Layer w0.254: U3.3 24.34,22.68 C11.2 22.28,22.69 22.28,24.65 21.26,25.67 21.26,29.35 21.82,29.91 FPC1.21 21.82,42.61 22.4,43.19 24.81,43.19 25.32,42.68 FPC1.14
  Top Layer w0.305: C11.2 21.91,23.05 U2.2
+3.3V: length 216.8
  Top Layer w0.305: U1.6 39.6,23.69 40,24.09 42.1,24.09 ; 7.29,34.94 7.29,44.6 C8.2 9.33,44.98 9.57,45.22 9.57,46.75 9.95,47.13 11.57,47.13 X3.4 ; 7.29,34.94 7.29,30.49 8,29.78 17.28,29.78 v1(17.34,29.73) C6.2 17.31,27.8 U2.3 16.72,22.68 C18.2 14.11,23.23 U7.3 ; 7.29,34.94 7.32,34.97 CARD1.4 ; U1.50 v1(50.65,35.06) ; v1(35.73,16.9) 35.73,21.89 U1.100 36.97,22.08 37.26,22.36 37.26,28.71 37.64,29.09 40.82,29.09 ; U1.11 42.1,24.09 ; 42.1,24.09 42.1,29.08 42.12,29.09 44.5,29.09 46.1,27.49 46.1,22.62 ; 40.82,29.09 40.82,31.37 38.27,33.92 37.64,33.92 37.1,34.46 U1.75 ; 40.82,29.09 v1(42.08,29.09) ; 47.6,22.62 48.56,22.62 49.02,23.08 U1.28 54.07,23.08 54.53,22.62 54.53,18.69 R7.2 R6.2 54.49,14.15 54.78,13.85 56.05,13.85 56.49,13.42 R4.2 56.49,11.14 56.82,10.81 58.85,10.81 60.63,9.03 H6.3 ; 47.6,22.62 46.1,22.62 ; 47.6,22.62 47.6,22.61 U1.22 U1.21 ; 46.02,43.57 v1(50.85,43.57) ; 46.1,22.62 U1.19 ; 50.85,40.14 54.02,40.14 54.67,40.79 C17.2 54.66,41.68 v1(54.66,43.57)
  Bottom Layer w0.254: LED18.2 28.33,27.53 28.62,27.82 28.62,30.24 28.24,30.62 18.22,30.62 v1(17.34,29.73)
  Bottom Layer w0.305: v1(17.34,29.73) 17.34,17.39 17.83,16.9 v1(35.73,16.9) ; v1(42.08,29.09) 42.08,30.11 43.99,32.01 49.96,32.01 50.65,32.71 v1(50.65,35.06) 51.74,36.15 51.74,39.13 50.85,40.02 50.85,40.14 ; v1(50.85,43.57) v1(54.66,43.57)
  vias: v1(50.65,40.14)
+5V: length 45.8
  Top Layer w0.355: U4.B4A9 7.7,8.28 ; 7.7,8.28 10.7,8.28 H8.1 13.13,7.5 13.37,7.74 C13.2 14.4,10.17 14.65,9.92 14.65,8.01 14.91,7.76 U6.4 16.48,4.66 16.52,4.62 ; 7.7,8.28 7.79,8.37 7.79,12.84 7.55,13.08 U4.A4B9 ; v1(23.92,11.57) U6.8 ; LED2.2 16.52,4.62 ; 16.52,4.62 FULL.2
  Bottom Layer w0.355: v1(23.92,11.57) 18.21,11.57 17.45,10.81 17.45,7.88 17.06,7.5 H8.1
GND: length 32.7
  Top Layer w0.254: U6.1 17.57,11.57 U6.9 18.84,9.03 U6.3 ; U1.99 34.55,22.58 34.21,22.23 v1(34.21,19.69) ; U1.10 41.6,18.93 ; X2.11 67.34,24.28 v1(67.36,24.27) 67.36,25.79 66.87,26.28 X2.7 ; X2.5 X2.6 X2.7 ; FPC1.23 20.82,36.84 ; X2.7 X2.8 ; U1.74 37.6,37.77 v1(37,38.36) ; U1.20 46.6,18.61 v1(46.91,18.3) ; FPC1.10 27.32,41.28 ; U1.27 52.54,22.58 v1(53.01,22.11)
  vias: v1(11.73,18.68) v1(19.48,29.73) v1(20.75,6.49) v1(22.53,33.92) v1(22.65,25.66) v1(27.73,26.43) v1(27.73,24.52) v1(32.69,35.19) v1(37.22,12.95) v1(37.22,8.15) v1(39.67,48.4) v1(39.86,28.2) v1(42.97,12.95) v1(42.97,8.15) v1(43.1,28.2) v1(43.1,22.62) v1(45.39,41.16) v1(47.54,26.05) v1(47.8,48.4) v1(48.72,12.95) v1(48.72,8.15) v1(50.59,12.95) v1(50.59,8.14) v1(52.88,13.98) v1(54.66,44.84) v1(55.93,48.4) v1(56.31,40.14) v1(56.31,33.41) v1(61.9,27.06) v1(62.53,20.84) v1(67.48,18.93)
VIN: length 50.1
  Top Layer w0.305: C16.2 7.92,16.9 7.41,17.41 7.41,19.57 6.4,20.58 EN1.2 ; C16.2 9.46,21.37 U7.2 ; C16.2 v1(9.46,14.61) ; v1(31.8,2.42) R17.2
  Bottom Layer w0.305: v1(31.8,2.42) 28.88,2.42 27.99,3.31 27.99,12.96 27.22,13.73 10.35,13.73 v1(9.46,14.61)
(no net): length 5.3
  Top Layer w0.254: v1(53.01,29.18) 52.61,29.58 U1.41 ; v1(48.43,29.18) 48.43,29.47 49.04,30.08 U1.42
B+: length 44.9
  Top Layer w0.305: R13.2 26.21,8.01 H3.1 25.32,7.88 25.07,7.63 25.07,4.84 C15.1 ; U6.5 v1(22.48,6.49) ; v1(6.02,18.04) 4.06,18.04 EN1.3
  Bottom Layer w0.305: v1(6.02,18.04) 7.54,18.04 8.43,17.16 8.43,13.98 9.44,12.96 25.7,12.96 26.34,12.33 H3.1 26.34,6.74 26.08,6.49 v1(22.48,6.49)
B-: length 20.6
  Top Layer w0.305: H4.1 31.67,7.88 32.18,8.39 32.18,12.46 31.8,12.84 30.43,12.84 C14.1 30.41,13.71 30.02,14.11 27.61,14.11 27.16,14.55 U5.6 27.16,16.71 26.59,17.28 24.3,17.28 23.6,16.58 Q1.6 Q1.7
BOOT0: length 6.3
  Top Layer w0.305: U1.94 32.99,25.08 32.18,24.27 32.18,23.63 31.67,23.12 30.42,23.12 R2.2
BOOT1: length 4.4
  Top Layer w0.305: R3.2 53.8,27.58 U1.37
DC-D0: length 24.8
  Top Layer w0.254: U1.63 43.1,37.47 v1(44.24,38.62) ; FPC1.6 v1(29.32,42.3)
  Bottom Layer w0.254: v1(44.24,38.62) 44.24,40.27 42.47,42.05 31.92,42.05 30.84,43.13 29.7,43.13 29.32,42.75 v1(29.32,42.3)
DC-D1: length 21.3
  Top Layer w0.254: v1(30.32,42.3) FPC1.4 ; U1.64 42.59,35.64 42.59,37.97 v1(43.24,38.62)
  Bottom Layer w0.254: v1(30.32,42.3) 31.21,41.41 41.45,41.41 43.24,39.62 v1(43.24,38.62)
DC-D2: length 23.8
  Top Layer w0.254: U1.97 33.52,23.58 32.56,22.62 v1(32.56,22.11) ; FPC1.3 v1(30.82,35.19)
  Bottom Layer w0.254: v1(30.82,35.19) 30.02,34.39 30.02,22.49 30.4,22.11 v1(32.56,22.11)
DC-D3: length 26.1
  Top Layer w0.254: v1(32.56,20.97) 33.07,20.97 33.57,21.47 33.57,22.49 34.16,23.08 U1.98 ; FPC1.5 v1(29.82,35.19)
  Bottom Layer w0.254: v1(32.56,20.97) 29.76,20.97 29.26,21.47 29.26,34.62 v1(29.82,35.19)
DC-D4: length 26.5
  Top Layer w0.254: U1.3 38.1,28.16 v1(38.15,28.2) ; v1(33.07,29.22) 33.07,33.03 31.67,34.43 29.26,34.43 28.82,34.86 FPC1.7
  Bottom Layer w0.254: v1(33.07,29.22) 34.08,28.2 v1(38.15,28.2)
DC-D5: length 19.8
  Top Layer w0.254: FPC1.9 27.82,33.32 28.37,32.78 30.78,32.78 31.54,32.01 31.54,26.81 32.27,26.08 U1.92
DC-D6: length 28.5
  Top Layer w0.254: FPC1.11 26.82,32.54 27.22,32.14 29.89,32.14 30.78,31.25 v1(30.78,28.58) ; v1(38.91,25.28) 38.6,24.97 U1.4
  Bottom Layer w0.254: v1(38.91,25.28) 38.91,25.54 37.77,26.68 33.07,26.68 31.16,28.58 v1(30.78,28.58)
DC-D7: length 31.5
  Top Layer w0.254: v1(30.78,27.51) 29.96,27.51 29.19,28.27 29.19,30.81 28.5,31.51 26.34,31.51 25.82,32.02 FPC1.13 ; v1(39.86,25.28) 39.1,24.52 U1.5
  Bottom Layer w0.254: v1(39.86,25.28) 38.85,24.27 34.02,24.27 v1(30.78,27.51)
DC-HS: length 40.4
  Top Layer w0.254: v1(30.78,26.43) 29.38,26.43 28.37,27.44 28.37,30.36 27.73,31 24.43,31 24.05,31.38 24.05,33.03 24.32,33.3 FPC1.16 ; U1.29 v1(47.54,23.58)
  Bottom Layer w0.254: v1(47.54,23.58) 32.23,23.58 30.78,25.03 v1(30.78,26.43)
DC-PLK: length 33.8
  Top Layer w0.254: v1(33.07,28.08) 32.31,28.84 32.31,32.78 31.54,33.54 28.88,33.54 28.32,34.09 FPC1.8 ; U1.31 v1(47.54,24.58)
  Bottom Layer w0.254: v1(33.07,28.08) 33.7,27.44 38.78,27.44 41.65,24.58 v1(47.54,24.58)
DC-PWDN: length 38.9
  Top Layer w0.254: v1(24.05,41.03) 23.82,40.8 FPC1.17 ; v1(45.39,38.62) 44.1,37.33 U1.61
  Bottom Layer w0.254: v1(24.05,41.03) 24.94,41.03 25.34,41.43 25.34,43.08 26.08,43.83 35.23,43.83 36.62,45.22 47.16,45.22 47.67,44.71 47.67,40.9 v1(45.39,38.62)
DC-RST: length 47.2
  Top Layer w0.254: FPC1.19 22.82,41.07 v1(24.05,42.3) ; U1.60 44.6,33.19 v1(44.31,32.9)
  Bottom Layer w0.254: v1(44.31,32.9) 44.31,35.64 48.43,39.76 48.43,45.09 47.67,45.86 36.12,45.86 34.72,44.46 24.81,44.46 24.05,43.7 v1(24.05,42.3)
DC-SCL: length 50.2
  Top Layer w0.254: v1(22.78,42.3) 22.32,41.84 FPC1.20 ; U1.59 45.1,33.19 v1(45.38,32.9)
  Bottom Layer w0.254: v1(45.38,32.9) 45.38,35.82 49.2,39.63 49.2,45.6 48.31,46.49 35.48,46.49 34.08,45.09 23.29,45.09 22.78,44.59 v1(22.78,42.3)
DC-SDA: length 54.3
  Top Layer w0.254: FPC1.22 21.32,41.79 v1(20.81,42.3) ; v1(46.45,32.9) 45.6,33.76 U1.58
  Bottom Layer w0.254: v1(46.45,32.9) 46.45,35.88 49.96,39.38 49.96,46.11 48.94,47.13 34.84,47.13 33.57,45.86 21.38,45.86 20.75,45.22 20.75,42.37 v1(20.81,42.3)
DC-VS: length 25.3
  Top Layer w0.254: U1.93 27.31,25.58 26.84,26.05 26.84,29.86 26.37,30.33 23.58,30.33 23.32,30.58 FPC1.18
DC-XLK: length 40.2
  Top Layer w0.254: v1(26.34,42.3) 26.32,42.29 FPC1.12 ; v1(42.12,38.62) 41.1,37.6 U1.67
  Top Layer w0.305: 14.27,47.29 16.27,47.29 16.94,46.62 16.94,45.35 17.7,44.59 25.45,44.59 26.34,43.7 v1(26.34,42.3)
  Bottom Layer w0.254: v1(42.12,38.62) 42.12,38.97 40.31,40.78 26.84,40.78 26.34,41.28 v1(26.34,42.3)
OSC-IN: length 18.4
  Top Layer w0.254: U1.12 42.6,18.18 41.96,17.54 41.96,15.65 R5.2 39.04,15.63 38.4,15 38.4,10.57 X1.2 38.42,6.02 C4.1
OSC-OUT: length 18.4
  Top Layer w0.254: C5.1 47.53,6.02 X1.1 47.54,10.57 47.54,14.87 46.78,15.63 R5.1 43.97,17.42 43.1,18.3 U1.13
PA0: length 40.5
  Top Layer w0.254: U1.23 48.1,18.12 48.56,17.66 51.61,17.66 v1(51.99,17.28) ; R17.1 36.74,2.42 ; 36.74,2.42 36.75,2.41 v1(36.75,1.79) ; 36.74,2.42 R18.2
  Bottom Layer w0.254: v1(36.75,1.79) 51.35,1.79 51.99,2.42 v1(51.99,17.28)
PA2-U2T: length 23.7
  Top Layer w0.254: U1.25 49.1,19.51 49.68,18.93 52.49,18.93 53.01,19.44 v1(53.01,20.53)
  Bottom Layer w0.254: H6.2 62.07,11.44 60.12,11.44 59.1,12.46 59.1,19.69 58.27,20.53 v1(53.01,20.53)
PA3-U2R: length 19.7
  Top Layer w0.254: v1(51.86,20.53) 51.09,20.53 50.65,20.97 U1.26
  Bottom Layer w0.254: v1(51.86,20.53) 52.68,21.35 59.23,21.35 59.99,20.58 59.99,14.61 60.5,14.11 H6.1
PA7: length 16.5
  Top Layer w0.254: v1(55.67,26.05) 54.15,24.52 53.13,24.52 52.58,25.08 U1.32 ; v1(61.9,28.14) 62.59,28.14 63.23,28.78 X2.2
  Bottom Layer w0.254: v1(55.67,26.05) 58.97,26.05 61.07,28.14 v1(61.9,28.14)
PA9-U1T: length 33.1
  Top Layer w0.254: U1.68 40.6,33.37 42.72,31.25 v1(46.06,31.25)
  Bottom Layer w0.254: H11.2 57.32,44.33 55.67,42.68 53.39,42.68 52.5,41.79 52.5,35.7 51.23,34.43 51.23,32.01 50.47,31.25 v1(46.06,31.25)
PA10-U1R: length 33.1
  Top Layer w0.254: v1(46.06,30.36) 42.85,30.36 40.1,33.11 U1.69
  Bottom Layer w0.254: H11.1 54.02,41.79 53.26,41.03 53.26,35.57 51.99,34.3 51.99,31.76 50.97,30.74 47.42,30.74 47.04,30.36 v1(46.06,30.36)
PB0: length 15.7
  Top Layer w0.254: v1(61.9,29.09) 62.53,29.09 62.72,29.28 X2.1 ; v1(54.91,26.81) 54.78,26.93 53.26,26.93 52.9,26.58 U1.35
  Bottom Layer w0.254: v1(61.9,29.09) 60.88,29.09 58.59,26.81 v1(54.91,26.81)
PB10: length 35.9
  Top Layer w0.254: U1.47 49.45,32.58 v1(46.06,29.18) ; v1(64.44,39) R11.2
  Bottom Layer w0.254: v1(46.06,29.18) 46.06,28.04 46.4,27.7 58.21,27.7 61.39,30.87 61.39,36.33 62.02,36.97 63.93,36.97 64.44,37.47 v1(64.44,39)
PB12: length 30
  Top Layer w0.254: X2.14 59.57,22.78 58.85,23.5 58.85,34.94 58.47,35.32 53.01,35.32 51.1,37.22 49.7,37.22 49.1,36.62 U1.51
PB13: length 34.7
  Top Layer w0.254: v1(48.47,32.9) 48.6,33.03 U1.52 ; X2.16 58.8,21.78 58.21,22.36 58.21,34.17 57.71,34.68 52.43,34.68 v1(50.65,36.46)
  Bottom Layer w0.254: v1(48.47,32.9) 48.47,34.28 v1(50.65,36.46)
PB14: length 37.7
  Top Layer w0.254: U1.53 48.1,33.6 v1(47.4,32.9) ; v1(50.65,38.75) 51.61,38.75 53.77,36.59 59.61,36.59 60.12,36.08 60.12,24.39 60.73,23.78 X2.12
  Bottom Layer w0.254: v1(47.4,32.9) 47.4,34.54 50.65,37.79 v1(50.65,38.75)
PB15: length 32.4
  Top Layer w0.254: U1.54 47.6,37.28 48.18,37.86 51.61,37.86 53.51,35.95 59.1,35.95 59.48,35.57 59.48,23.76 59.96,23.28 X2.13
PC2: length 47.4
  Top Layer w0.254: U1.17 v1(45.1,22.62) ; v1(58.09,14.23) 60.75,16.9 67.74,16.9 68.37,17.54 68.37,27.7 67.79,28.28 X2.3
  Bottom Layer w0.254: v1(45.1,22.62) 50.21,22.62 50.72,22.11 50.72,19.95 51.48,19.19 57.07,19.19 58.09,18.17 v1(58.09,14.23)
PC3: length 44.9
  Top Layer w0.254: v1(67.36,27.31) 66.89,27.78 X2.4 ; U1.18 45.6,18.47 v1(45.77,18.3) ; v1(58.09,13.09) v1(61.01,16.01)
  Bottom Layer w0.254: v1(67.36,27.31) 68.37,26.3 68.37,16.9 67.48,16.01 v1(61.01,16.01) ; v1(58.09,13.09) 57.58,13.09 56.94,13.73 56.94,17.28 55.93,18.3 48.94,18.3 48.05,17.41 46.28,17.41 45.77,17.92 v1(45.77,18.3)
PC4: length 22
  Top Layer w0.254: v1(53.64,25.28) 53.35,25.58 U1.33 ; X2.17 v1(67.48,21.28)
  Bottom Layer w0.254: v1(53.64,25.28) 53.64,23.5 54.28,22.87 62.53,22.87 64.18,21.22 67.42,21.22 v1(67.48,21.28)
PC5: length 21.9
  Top Layer w0.254: v1(53.64,26.3) 53.42,26.08 U1.34 ; X2.15 v1(67.48,22.28)
  Bottom Layer w0.254: v1(53.64,26.3) 54.15,26.3 54.53,25.92 54.53,24.27 55.16,23.63 63.04,23.63 64.44,22.23 67.44,22.23 v1(67.48,22.28)
PC13: length 12.3
  Top Layer w0.254: R21.2 33.7,15.25 34.08,14.87 36.37,14.87 37,15.5 37,18.17 37.51,18.68 39.8,18.68 40.1,18.98 U1.7
PC14: length 42.2
  Top Layer w0.254: v1(50.59,3.82) 49.94,3.17 R20.2 ; U1.8 40.6,22.74
  Bottom Layer w0.254: v1(50.59,3.82) 49.7,4.71 43.74,4.71 43.23,5.22 40.56,5.22 39.8,4.45 35.73,4.45 34.72,5.47 34.72,13.09 35.48,13.85 37.89,13.85 38.78,14.74 38.78,17.16 40.6,18.97 40.6,22.74
  vias: v1(40.6,22.62)
PC15: length 34.9
  Top Layer w0.254: R19.2 45.13,2.48 v1(45.13,3.82) ; U1.9 41.1,18.33 40.56,17.79 v1(38.15,17.79)
  Bottom Layer w0.254: v1(45.13,3.82) 43.1,3.82 42.34,4.58 41.07,4.58 40.31,3.82 35.23,3.82 34.08,4.96 34.08,13.73 34.84,14.49 37.38,14.49 38.15,15.25 v1(38.15,17.79)
PD8: length 22.9
  Top Layer w0.254: U1.55 47.1,37.67 50.59,41.16 52.24,41.16 53.39,42.3 53.39,45.22 54.02,45.86 61.26,45.86 61.69,46.29 SW3.4
PD9: length 15.3
  Top Layer w0.254: U1.56 46.6,38.05 50.34,41.79 51.74,41.79 52.62,42.68 52.62,45.98 53.56,46.92 SW2.4
PD10: length 19.5
  Top Layer w0.254: U1.57 46.1,38.44 50.34,42.68 51.35,42.68 51.74,43.06 51.74,44.97 50.97,45.73 46.91,45.73 45.44,47.2 SW1.4
PE12: length 24.7
  Top Layer w0.254: v1(47.25,29.18) 48.64,30.58 U1.43
  Bottom Layer w0.254: H10.1 60.12,31.25 58.85,29.98 48.04,29.98 v1(47.25,29.18)
PE13: length 14
  Top Layer w0.254: v1(53.01,30.74) 52.75,30.74 52.42,31.08 U1.44
  Bottom Layer w0.254: H10.2 57.58,31.76 56.56,30.74 v1(53.01,30.74)
PE14: length 10.6
  Top Layer w0.254: v1(53.01,31.7) 52.88,31.58 U1.45
  Bottom Layer w0.254: v1(53.01,31.7) 54.35,31.7 55.04,32.39 H10.3
RST: length 25.3
  Top Layer w0.254: U1.14 43.6,18.81 45.51,16.9 50.59,16.9 51.61,15.89 51.61,12.84 52.12,12.33 54.47,12.33 R4.1 54.49,9.36 C3.2 54.28,7.64 53.16,6.51 53.16,4.6
SD-CLK: length 29
  Top Layer w0.254: 17.32,36.2 17.18,36.07 CARD1.5 ; U1.80 34.02,32.08 33.7,32.39 v1(33.7,38.36)
  Bottom Layer w0.254: 17.32,36.2 17.45,36.08 17.7,36.08 19.99,38.36 v1(33.7,38.36)
  vias: v1(17.32,36.01)
SD-CMD: length 36.9
  Top Layer w0.254: 17.32,35.06 16.13,33.87 CARD1.3 ; U1.83 v1(38.66,30.58)
  Bottom Layer w0.254: 17.32,35.06 17.45,34.94 17.83,34.94 20.49,37.6 37.89,37.6 39.42,36.08 39.42,31.34 v1(38.66,30.58)
  vias: v1(17.32,34.9)
SD-D0: length 40.3
  Top Layer w0.254: CARD1.7 13.76,38.24 15.41,38.24 16.43,37.22 17.32,37.22 ; U1.65 42.1,34.03 43.1,33.03 43.23,33.03
  Bottom Layer w0.254: 17.32,37.22 17.7,37.22 19.73,39.25 39.29,39.25 40.31,38.24 40.31,33.41 41.7,32.01 42.59,32.01 43.23,32.65 43.23,32.9
  vias: v1(17.32,37.13) v1(43.24,32.9)
SD-D1: length 38.2
  Top Layer w0.254: CARD1.8 13.74,39.38 16.18,39.38 v1(17.32,38.24) ; 42.08,33.03 41.6,33.51 U1.66
  Bottom Layer w0.254: v1(42.16,32.9) 41.07,34 41.07,38.75 39.8,40.02 19.1,40.02 v1(17.32,38.24)
SD-D2: length 30.5
  Top Layer w0.254: v1(37.89,33.03) 37.85,33.08 U1.78 ; v1(17.32,32.52) 16.47,31.67 CARD1.1
  Bottom Layer w0.254: v1(17.32,32.52) 17.95,32.52 21.38,35.95 36.62,35.95 37.89,34.68 v1(37.89,33.03)
SD-D3: length 34.3
  Top Layer w0.254: v1(38.64,31.77) 37.88,31.77 37.08,32.58 U1.79 ; CARD1.2 16.3,32.77 v1(17.32,33.79)
  Bottom Layer w0.254: v1(17.32,33.79) 17.95,33.79 20.88,36.71 37.51,36.71 38.64,35.58 v1(38.64,31.77)
SWCLK: length 17.7
  Top Layer w0.305: H1.3 40.94,44.97 40.56,45.35 36.37,45.35 35.86,44.84 35.86,34.39 U1.76
SWDIO: length 10.6
  Top Layer w0.305: 43.48,43.57 43.48,41.16 40.18,37.86 39.16,37.86 38.6,37.29 U1.72
TFT-BLK: length 15.4
  Top Layer w0.254: R7.1 56.44,18.7 v1(56.44,25.28) ; X2.9 v1(61.9,25.28)
  Bottom Layer w0.254: v1(61.9,25.28) v1(56.44,25.28)
TFT-VCC: length 18.5
  Top Layer w0.254: v1(57.32,24.52) 57.32,20.71 57.96,20.08 57.96,15.76 57.68,15.48 R6.1 ; v1(62.53,24.52) 62.79,24.78 X2.10
  Bottom Layer w0.254: v1(57.32,24.52) v1(62.53,24.52)
$1N1237: length 6.2
  Top Layer w0.305: C1.2 54.91,31.41 54.91,33.16 54.49,33.58 U1.49
$1N1238: length 5.7
  Top Layer w0.305: U1.73 38.1,38.06 38.53,38.49 39.8,38.49 40.05,38.75 40.05,39.75 C2.2
$1N6160: length 22.7
  Top Layer w0.254: R15.1 11.15,4.71 v1(9.44,4.71) ; 22.48,10.3 v1(23.92,10.3)
  Bottom Layer w0.254: v1(9.44,4.71) 17.83,4.71 18.34,5.22 18.34,9.79 18.84,10.3 v1(23.92,10.3)
$1N6161: length 7.1
  Top Layer w0.254: U6.6 23.54,9.03 23.92,8.65 23.92,5.47 23.29,4.84 21.94,4.84 R16.1
$1N6166: length 5.5
  Top Layer w0.254: R14.2 14.78,13.22 15.03,12.96 15.03,10.81 15.54,10.3 16.48,10.3
$1N6175: length 8.8
  Top Layer w0.254: U5.5 R13.1
  Top Layer w0.305: C14.2 30.4,10.81 28.62,10.81 28.24,11.19 28.24,12.46 27.88,12.82 R13.1
$1N6180: length 6.4
  Top Layer w0.254: U5.2 26.21,19.31 26.59,19.69 29.89,19.69 30.4,19.19 R12.2
$1N6185: length 11.2
  Top Layer w0.254: U5.3 24.98,18.81 18.84,18.81 18.46,18.42 18.46,16.39 18,15.93 Q1.4
$1N6186: length 11.2
  Top Layer w0.254: v1(22.4,15.25) 22.4,15.92 Q1.5 ; 28.5,15.22 28.5,18.17 28.14,18.52 U5.1
  Bottom Layer w0.254: v1(22.4,15.25) v1(28.5,15.25)
$1N6188: length 3.7
  Top Layer w0.254: R16.2 18.74,2.79 FULL.1
$1N7981: length 3.4
  Top Layer w0.254: R11.1 67.56,42.48 PB10.2
$1N8698: length 3.7
  Top Layer w0.254: R15.2 14.39,2.79 LED2.1
$1N13231: length 49.8
  Top Layer w0.254: 41.68,3.69 41.8,3.82 42.47,3.82 43.07,3.21 R19.1
  Bottom Layer w0.254: 41.68,3.69 41.17,3.19 34.46,3.19 33.45,4.2 33.45,14.61 34.08,15.25 37,15.25 37.38,15.63 37.38,18.04 36.81,18.62 25.76,18.62 24.69,19.69 24.69,27.53 LED18.1
  vias: v1(41.68,3.82)
$1N13309: length 59.8
  Top Layer w0.254: R20.1 47.94,3.55 47.67,3.82 v1(46.53,3.82)
  Bottom Layer w0.254: LED18.4 24.64,29.09 23.41,29.09 23.16,28.84 23.16,26.68 24.05,25.79 24.05,18.93 24.94,18.04 35.99,18.04 36.62,17.41 36.62,16.52 35.99,15.89 33.57,15.89 32.69,15 32.69,3.69 33.83,2.55 46.02,2.55 46.53,3.06 v1(46.53,3.82)
$1N14969: length 19.2
  Top Layer w0.254: v1(32.56,19.57) 32.56,18.3 32.81,18.04 33.59,18.04 R21.1
  Bottom Layer w0.254: LED18.3 26.63,29.13 26.21,28.71 26.21,20.08 26.72,19.57 v1(32.56,19.57)

## Copper pours and planes (outline as drawn; the poured copper is in the pictures)
GND on Top Layer: -0.08,50.05 70.02,50.05 70.02,0.01 -0.08,0.01
GND on Bottom Layer: -0.08,50.05 70.02,50.05 70.02,0.01 -0.08,0.01

Small or netless copper shapes (teardrops, artwork), in the pictures only: 333 on Top Layer, 114 on Bottom Layer

## Text on the board
Bottom Silkscreen Layer: QinYuYQY. | 5V | GND | + | — | 太 / 宰 / 治 / 向 / 着 / 光 / 明 | 所 / 谓 / 现 / 实 / ， | 应 / 是 / 要 / 使 / 人 / 感 / 受 / 到 / 它 / 的 / 存 / 在 / ， | 而 / 不 / 是 / 强 / 迫 / 人 / 相 / 信 / 它 / 。
Top Silkscreen Layer: QinYuYQY. | PA3-U2R | PA2-U2T | 3.3V | GND | PE14 | PE13 | PE12 | PA9 | PA10 | ON | DW01a | PD10 | CLK | DIO | PD9 | PD8 | 2.4 / 60*44mm | 2.8 / 70*50mm | stm32f407ve | 25MHz | 5V | ME6206A-- | SC8205A | TP4056X | 2.8V | 1.8V | 24p | RST | 18p | chrg | full | + | —
